# Altium project Soccer A.PrjPCB
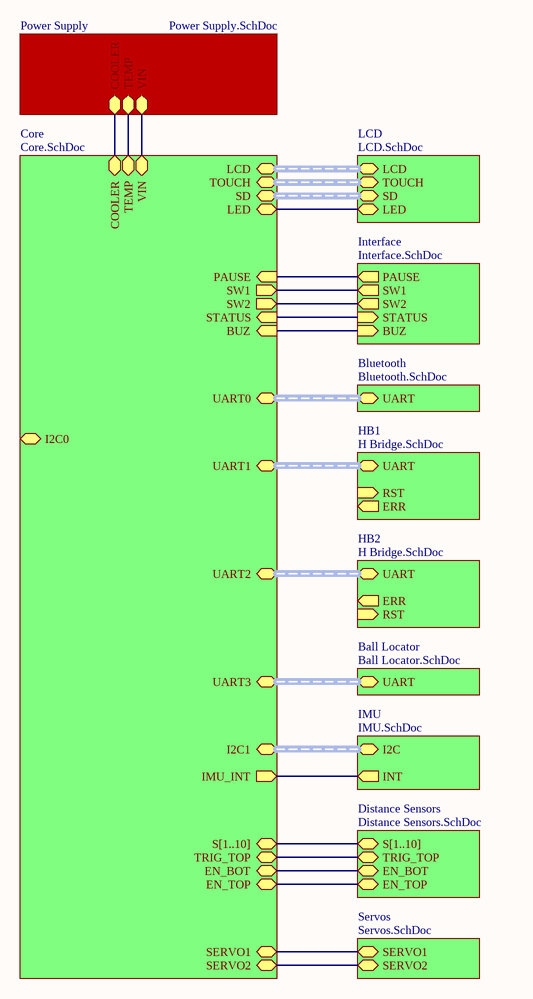
[diagram p0: General.SchDoc]
13 sheets, 238 parts. Net scope: hierarchical (ports join the sheet entries above them; power ports are global).
Board file: Main.PcbDoc
Sheets:
  General.SchDoc
    Core = Core.SchDoc
    IMU = IMU.SchDoc
    Bluetooth = Bluetooth.SchDoc
    HB1 = H Bridge.SchDoc
    HB2 = H Bridge.SchDoc
    LCD = LCD.SchDoc
    Interface = Interface.SchDoc
    Ball Locator = Ball Locator.SchDoc
      DBS1 = Digital Ball Sensor.SchDoc
      DBS2 = Digital Ball Sensor.SchDoc
      DBS3 = Digital Ball Sensor.SchDoc
      DBS4 = Digital Ball Sensor.SchDoc
      DBS5 = Digital Ball Sensor.SchDoc
      DBS6 = Digital Ball Sensor.SchDoc
      DBS7 = Digital Ball Sensor.SchDoc
      DBS8 = Digital Ball Sensor.SchDoc
      DBS9 = Digital Ball Sensor.SchDoc
      DBS10 = Digital Ball Sensor.SchDoc
      DBS11 = Digital Ball Sensor.SchDoc
      DBS12 = Digital Ball Sensor.SchDoc
      DBS13 = Digital Ball Sensor.SchDoc
      DBS14 = Digital Ball Sensor.SchDoc
      DBS15 = Digital Ball Sensor.SchDoc
      DBS16 = Digital Ball Sensor.SchDoc
      1 = Analog Ball Sensor.SchDoc
      2 = Analog Ball Sensor.SchDoc
    Power Supply = Power Supply.SchDoc
    Distance Sensors = Distance Sensors.SchDoc
    Servos = Servos.SchDoc

## Sheet General.SchDoc
size A4; SheetNumber: 1; SheetTotal: 3

### Sub-sheets
Ball Locator = Ball Locator.SchDoc: UART (harness UART)
Bluetooth = Bluetooth.SchDoc: UART (harness UART)
Core = Core.SchDoc: VIN, LCD (harness LCD_BUS), TOUCH (harness TOUCH_BUS), PAUSE (in), UART3 (harness UART), UART1 (harness UART), UART2 (harness UART), I2C0 (harness I2C), I2C1 (harness I2C), UART0 (harness UART), STATUS (in), SW1 (out), SW2 (out), LED, SD (harness SD), IMU_INT (out), S[1..10], EN_BOT, EN_TOP, SERVO1, SERVO2, TEMP, COOLER, TRIG_TOP, BUZ (in)
Distance Sensors = Distance Sensors.SchDoc: S[1..10], EN_BOT, EN_TOP, TRIG_TOP
HB1 = H Bridge.SchDoc: RST (in), ERR (out), UART (harness UART)
HB2 = H Bridge.SchDoc: RST (in), ERR (out), UART (harness UART)
IMU = IMU.SchDoc: INT (out), I2C (harness I2C)
Interface = Interface.SchDoc: PAUSE (out), SW1 (out), SW2 (out), STATUS (in), BUZ (in)
LCD = LCD.SchDoc: LCD (harness LCD_BUS), TOUCH (harness TOUCH_BUS), LED, SD (harness SD)
Power Supply = Power Supply.SchDoc: VIN, TEMP, COOLER
Servos = Servos.SchDoc: SERVO1, SERVO2

### Nets
Net*_3: sheet Core/PAUSE, sheet Interface/PAUSE
Net*_4: sheet Core/EN_TOP, sheet Distance Sensors/EN_TOP
Net*_5: sheet Core/EN_BOT, sheet Distance Sensors/EN_BOT
Net*_6: sheet Core/SW1, sheet Interface/SW1
Net*_7: sheet Core/SW2, sheet Interface/SW2
Net*_8: sheet Core/STATUS, sheet Interface/STATUS
Net*_9: sheet Core/LED, sheet LCD/LED
Net*_10: sheet Core/TRIG_TOP, sheet Distance Sensors/TRIG_TOP
Net*_11: sheet Core/COOLER, sheet Power Supply/COOLER
Net*_12: sheet Core/SERVO1, sheet Servos/SERVO1
Net*_13: sheet Core/SERVO2, sheet Servos/SERVO2
Net*_22: sheet Core/BUZ, sheet Interface/BUZ
Net*_32: sheet Core/IMU_INT, sheet IMU/INT
Net*_A10: sheet Core/TEMP, sheet Power Supply/TEMP
Net*_A11: sheet Core/VIN, sheet Power Supply/VIN

### Buses and harness runs
bus sheet Core/S[1..10] = sheet Distance Sensors/S[1..10]
harness sheet Ball Locator/UART = sheet Core/UART3
harness sheet Bluetooth/UART = sheet Core/UART0
harness sheet Core/I2C1 = sheet IMU/I2C
harness sheet Core/LCD = sheet LCD/LCD
harness sheet Core/SD = sheet LCD/SD
harness sheet Core/TOUCH = sheet LCD/TOUCH
harness sheet Core/UART1 = sheet HB1/UART
harness sheet Core/UART2 = sheet HB2/UART

## Sheet Core.SchDoc
size A4
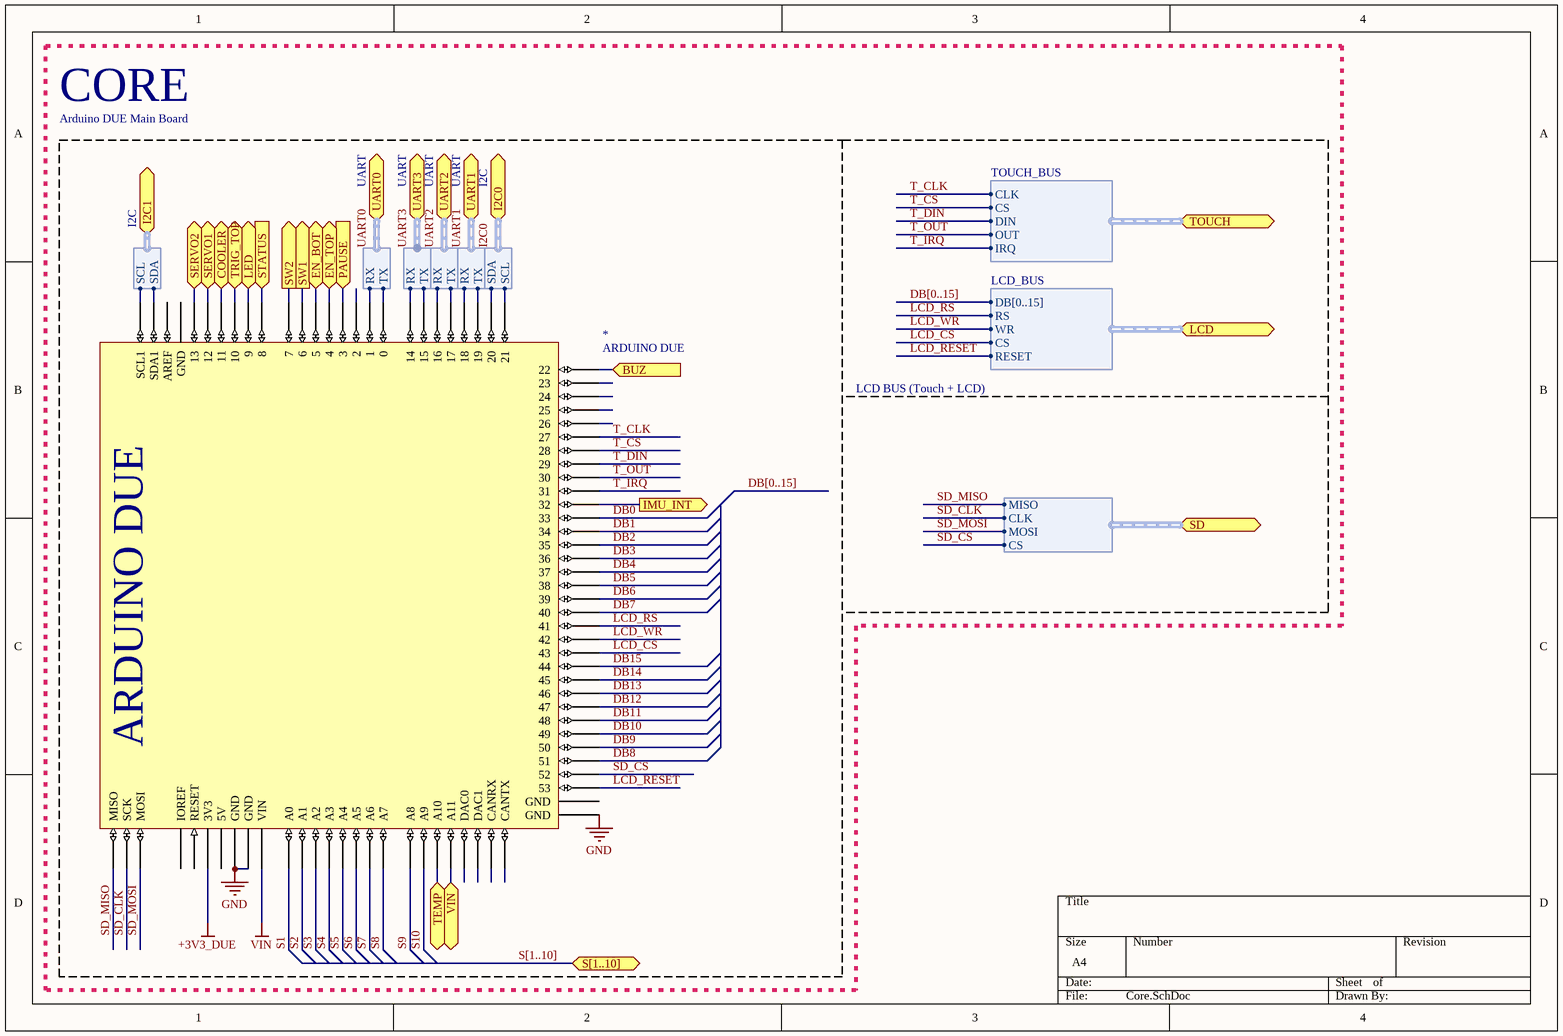
[diagram p1: Core.SchDoc]

### Parts
*  ARDUINO DUE  [ARDUINO-DUE]

### Blocks framed on the sheet
Arduino DUE Main Board: *

### Ports
BUZ (in), COOLER, EN_BOT, EN_TOP, I2C0 (harness I2C), I2C1 (harness I2C), IMU_INT (out), LCD (harness LCD_BUS), LED, PAUSE (in), S[1..10], SD (harness SD), SERVO1, SERVO2, STATUS (in), SW1 (out), SW2 (out), TEMP, TOUCH (harness TOUCH_BUS), TRIG_TOP, UART0 (harness UART), UART1 (harness UART), UART2 (harness UART), UART3 (harness UART), VIN

### Harnesses
LCD_BUS: CS, DB[0..15], RESET, RS, WR
TOUCH_BUS: CLK, CS, DIN, OUT, IRQ
UART: RX, TX
I2C: SDA, SCL
SD: MISO, MOSI, CLK, CS

### Nets
+3V3_DUE: *.3V3
GND: *.GND2(GND) *.GND3(GND) *.GND5(GND)
VIN: *.VIN
BL.RX: *.14 ; port UART3.RX
BL.TX: *.15 ; port UART3.TX
DB0: *.33
DB1: *.34
DB2: *.35
DB3: *.36
DB4: *.37
DB5: *.38
DB6: *.39
DB7: *.40
DB8: *.51
DB9: *.50
DB10: *.49
DB11: *.48
DB12: *.47
DB13: *.46
DB14: *.45
DB15: *.44
LCD_CS: *.43 ; port LCD.CS
LCD_RESET: *.53 ; port LCD.RESET
LCD_RS: *.41 ; port LCD.RS
LCD_WR: *.42 ; port LCD.WR
RX: *.16 ; port UART2.RX
RX: *.18 ; port UART1.RX  [a separate net that carries the same name]
S1: *.A0
S2: *.A1
S3: *.A2
S4: *.A3
S5: *.A4
S6: *.A5
S7: *.A6
S8: *.A7
S9: *.A8
S10: *.A9
SD_CLK: *.SCK ; port SD.CLK
SD_CS: *.52 ; port SD.CS
SD_MISO: *.MISO ; port SD.MISO
SD_MOSI: *.MOSI ; port SD.MOSI
T_CLK: *.27 ; port TOUCH.CLK
T_CS: *.28 ; port TOUCH.CS
T_DIN: *.29 ; port TOUCH.DIN
T_IRQ: *.31 ; port TOUCH.IRQ
T_OUT: *.30 ; port TOUCH.OUT
UART.RX: *.1 ; port UART0.RX
UART.TX: *.0 ; port UART0.TX
Net*_3: *.3 ; port PAUSE
Net*_4: *.4 ; port EN_TOP
Net*_5: *.5 ; port EN_BOT
Net*_6: *.6 ; port SW1
Net*_7: *.7 ; port SW2
Net*_8: *.8 ; port STATUS
Net*_9: *.9 ; port LED
Net*_10: *.10 ; port TRIG_TOP
Net*_11: *.11 ; port COOLER
Net*_12: *.12 ; port SERVO1
Net*_13: *.13 ; port SERVO2
Net*_17: *.17 ; port UART2.TX
Net*_19: *.19 ; port UART1.TX
Net*_20: *.20 ; port I2C0.SDA
Net*_21: *.21 ; port I2C0.SCL
Net*_22: *.22 ; port BUZ
Net*_32: *.32 ; port IMU_INT
Net*_A10: *.A10 ; port TEMP
Net*_A11: *.A11 ; port VIN
Net*_SCL1: *.SCL1 ; port I2C1.SCL
Net*_SDA1: *.SDA1 ; port I2C1.SDA

Not connected (* = marked no-connect by the designer): * 2 5V 23 24 25 26 AREF CANRX CANTX DAC0 DAC1 GND1(GND) GND4(GND) IOREF RESET

### Buses and harness runs
bus DB[0..15]
bus S[1..10] = port S[1..10]

### Notes on the sheet
- CORE
- LCD BUS (Touch + LCD)
- Labels drawn without touching a wire or pin: I2C0, UART0, UART1, UART2, UART3

## Sheet IMU.SchDoc: IMU Sensor
size A4; DrawnBy: Ivan Seidel; ProjectName: Soccer B Robot
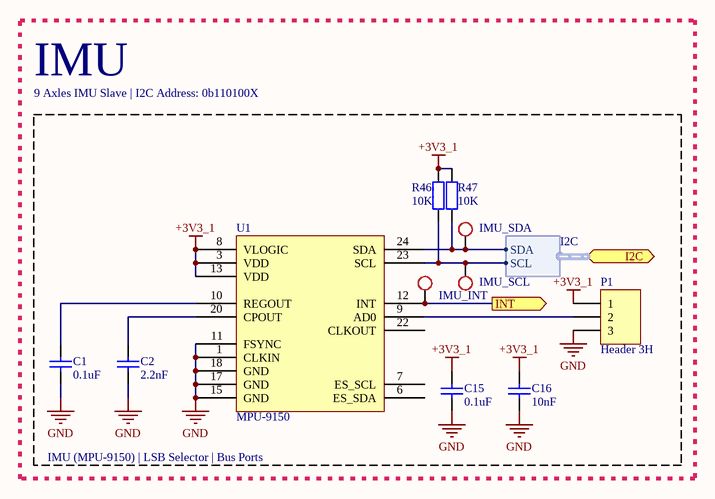
[diagram p2: IMU.SchDoc]

### Parts
C1  0.1uF  [C0805]
C2  2.2nF  [C0805]
C15  0.1uF  [C0805]
C16  10nF  [C0805]
IMU_INT  Test Point  [TP1]  (value not drawn)  (no BOM)
IMU_SCL  Test Point  [TP1]  (value not drawn)  (no BOM)
IMU_SDA  Test Point  [TP1]  (value not drawn)  (no BOM)
P1  Header 3H  [HDR1X3H]
R46  10K  [RES1206]
R47  10K  [RES1206]
U1  MPU-9150  [QFN50P400X400X100-24N]

### Ports
I2C (harness I2C), INT (out)

### Harnesses
I2C: SCL, SDA

### Nets
+3V3_1: C15.2 C16.2 P1.1 R46.1 R47.1 U1.3(VDD) U1.8(VLOGIC) U1.13(VDD)
GND: C1.1 C2.1 C15.1 C16.1 P1.3 U1.1(CLKIN) U1.11(FSYNC) U1.15(GND) U1.17(GND) U1.18(GND)
Net*_32: IMU_INT.1 U1.12(INT) ; port INT
Net*_SCL1: IMU_SCL.1 R46.2 U1.23(SCL) ; port I2C.SCL
Net*_SDA1: IMU_SDA.1 R47.2 U1.24(SDA) ; port I2C.SDA
NetC1_2: C1.2 U1.10(REGOUT)
NetC2_2: C2.2 U1.20(CPOUT)
NetP1_2: P1.2 U1.9(AD0)

Not connected (* = marked no-connect by the designer): U1 6(ES_SDA) 7(ES_SCL) 22(CLKOUT)

### Notes on the sheet
- IMU
- 9 Axles IMU Slave | I2C Address: 0b110100X
- IMU (MPU-9150) | LSB Selector | Bus Ports

### Library data of the parts
C1 C2 C15 C16 = Cap Semi: Capacitor (Semiconductor SIM Model); Published: 8-Jun-2000; LatestRevisionDate: 29-May-2009; LatestRevisionNote: IPC-7351 Footprint Added.; PackageReference: C1206; Publisher: Altium Limited; PackageDescription: Chip Capacitor
  C1 C15: Value: 0.1uF
  C2: Value: 2.2nF
  C16: Value: 10nF
IMU_INT IMU_SCL IMU_SDA = Test Point: Test Point for Osciloscope measurements
P1 = Header 3H: Header, 3-Pin, Right Angle; LatestRevisionDate: 17-Jul-2002; LatestRevisionNote: Re-released for DXP Platform.; Publisher: Altium Limited
R46 R47 = RES
U1 = MPU-9150: InveSense MPU-9150 IMU 9 axles

## Sheet Bluetooth.SchDoc
size A4
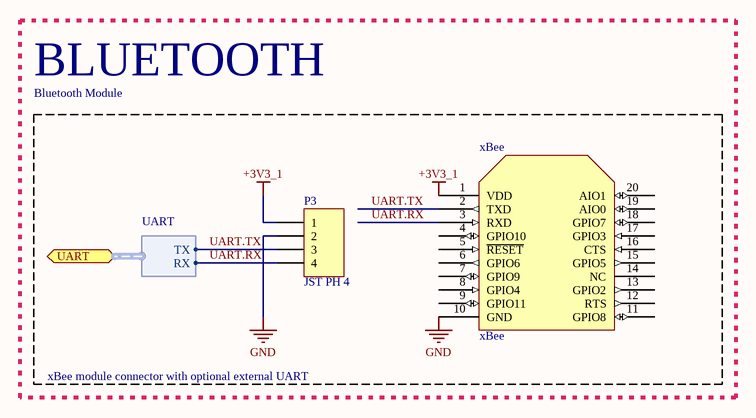
[diagram p3: Bluetooth.SchDoc]

### Parts
P3  JST PH 4  [B4B-PH-K]
xBee  xBee  [xBee]

### Blocks framed on the sheet
BLUETOOTH: P3 xBee

### Ports
UART (harness UART)

### Harnesses
UART: RX, TX

### Nets
+3V3_1: P3.1 xBee.1(VDD)
GND: P3.2 xBee.10(GND)
UART.RX: P3.4 xBee.3(RXD) ; port UART.RX
UART.TX: P3.3 xBee.2(TXD) ; port UART.TX

Not connected (* = marked no-connect by the designer): xBee 4(GPIO10) 5(~{RESET}) 6(GPIO6) 7(GPIO9) 8(GPIO4) 9(GPIO11) 11(GPIO8) 12(RTS) 13(GPIO2) 14(NC) 15(GPIO5) 16(CTS) 17(GPIO3) 18(GPIO7) 19(AIO0) 20(AIO1)

### Notes on the sheet
- Bluetooth Module
- xBee module connector with optional external UART

## Sheet H Bridge.SchDoc
size A4
Used 2 times, as channels HB1, HB2. Parts and nets are listed once, with the designators drawn on the sheet.
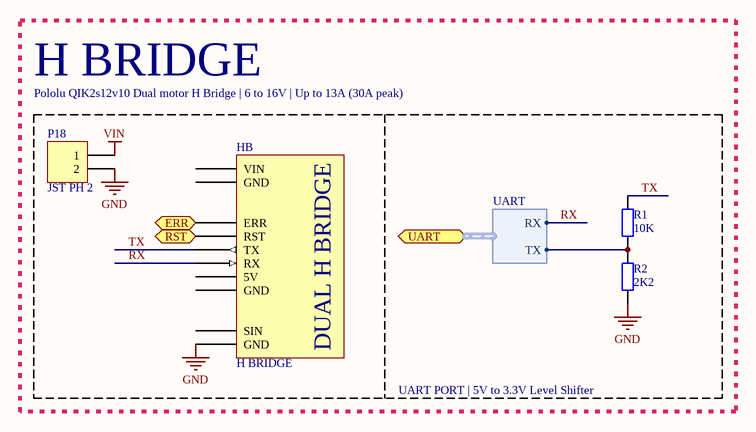
[diagram p4: H Bridge.SchDoc]

### Parts
HB  H BRIDGE  [POLOLU-QIK-2S12V10-BOTTOM]
P18  JST PH 2  [B2B-PH-K]
R1  10K  [RES1206]
R2  2K2  [RES1206]

### Blocks framed on the sheet
UART PORT | 5V to 3.3V Level Shifter: HB P18 R1 R2

### Ports
ERR (out), RST (in), UART (harness UART)

### Harnesses
UART: RX, TX

### Nets
GND: HB.GND3(GND) P18.2 R2.1
VIN: P18.1
ERR: HB.ERR ; port ERR
RST: HB.RST ; port RST
RX: HB.RX ; port UART.RX
TX: HB.TX R1.2
NetR1_1: R1.1 R2.2 ; port UART.TX

Not connected (* = marked no-connect by the designer): HB 5V GND1(GND) GND2(GND) SIN VIN

### Channels
HB1: designators end in _HB1; ports ERR=NetHB_HB1_ERR RST=NetHB_HB1_RST
HB2: designators end in _HB2; ports ERR=NetHB_HB2_ERR RST=NetHB_HB2_RST

### Notes on the sheet
- H BRIDGE
- Pololu QIK2s12v10 Dual motor H Bridge | 6 to 16V | Up to 13A (30A peak)
- (in symbol POLOLU-QIK-2S12V10) DUAL H BRIDGE

### Library data of the parts
HB = POLOLU-QIK-2S12V10: POLOLU QIK 2S12V10 DUAL H BRIDGE
R1 R2 = RES

## Sheet LCD.SchDoc
size A4
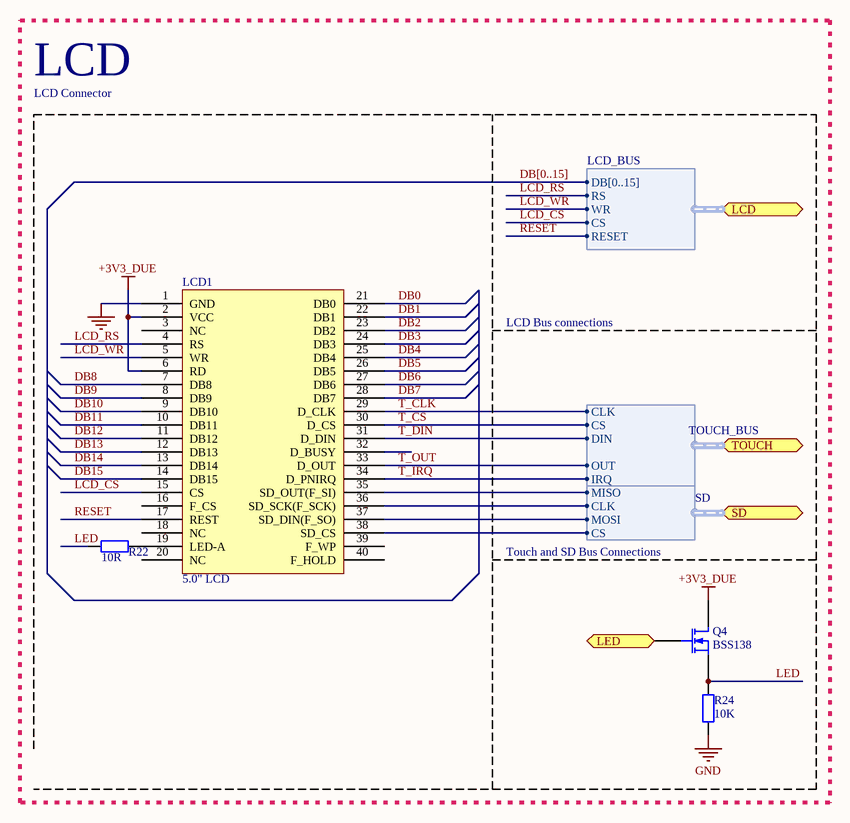
[diagram p5: LCD.SchDoc]

### Parts
LCD1  5.0" LCD  [TFT LCD 5.0 INCHES]
Q4  BSS138  [SOT23]
R22  10R  [RES1206]
R24  10K  [RES1206]

### Ports
LCD (harness LCD_BUS), LED, SD (harness SD), TOUCH (harness TOUCH_BUS)

### Harnesses
LCD_BUS: DB[0..15], RS, WR, CS, RESET
TOUCH_BUS: CLK, CS, DIN, OUT, IRQ
SD: MISO, MOSI, CLK, CS

### Nets
+3V3_DUE: LCD1.2(VCC) LCD1.6(RD) Q4.1(D)
GND: LCD1.1(GND) R24.2
DB0: LCD1.21(DB0)
DB1: LCD1.22(DB1)
DB2: LCD1.23(DB2)
DB3: LCD1.24(DB3)
DB4: LCD1.25(DB4)
DB5: LCD1.26(DB5)
DB6: LCD1.27(DB6)
DB7: LCD1.28(DB7)
DB8: LCD1.7(DB8)
DB9: LCD1.8(DB9)
DB10: LCD1.9(DB10)
DB11: LCD1.10(DB11)
DB12: LCD1.11(DB12)
DB13: LCD1.12(DB13)
DB14: LCD1.13(DB14)
DB15: LCD1.14(DB15)
LCD_CS: LCD1.15(CS) ; port LCD.CS
LCD_RS: LCD1.4(RS) ; port LCD.RS
LCD_WR: LCD1.5(WR) ; port LCD.WR
LED: Q4.2(S) R22.2 R24.1
RESET: LCD1.17(REST) ; port LCD.RESET  [project net LCD_RESET]
SD_CLK: LCD1.36(SD_SCK(F_SCK)) ; port SD.CLK
SD_CS: LCD1.38(SD_CS) ; port SD.CS
SD_MISO: LCD1.35(SD_OUT(F_SI)) ; port SD.MISO
SD_MOSI: LCD1.37(SD_DIN(F_SO)) ; port SD.MOSI
T_CLK: LCD1.29(D_CLK) ; port TOUCH.CLK
T_CS: LCD1.30(D_CS) ; port TOUCH.CS
T_DIN: LCD1.31(D_DIN) ; port TOUCH.DIN
T_IRQ: LCD1.34(D_PNIRQ) ; port TOUCH.IRQ
T_OUT: LCD1.33(D_OUT) ; port TOUCH.OUT
Net*_9: Q4.3(G) ; port LED
NetLCD1_19: LCD1.19(LED-A) R22.1

Not connected (* = marked no-connect by the designer): LCD1 3(NC) 16(F_CS) 18(NC) 20(NC) 32(D_BUSY) 39(F_WP) 40(F_HOLD)

### Buses and harness runs
bus DB[0..15]

### Notes on the sheet
- LCD
- LCD Connector
- LCD Bus connections
- Touch and SD Bus Connections

### Library data of the parts
LCD1 = TFT LCD 5.0 INCHES
Q4 = BSS138: N-Channel Enhancement Mode Vertical DMOS FET; Published: 17-Dec-2003; DatasheetVersion: Mar-96; PackageVersion: 1996; PackageReference: SOT23; Publisher: Altium Limited; PackageDescription: SOT-23; 3 Leads; Body 3.1 x 2.5 mm, inc. leads (LxW max), Alternate Lead Configuration; ComponentLink1Description: Manufacturer Link; ComponentLink1URL: http://www.zetex.com/; ComponentLink2Description: Datasheet; ComponentLink2URL: www.zetex.com/3.0/pdf/BSS138.pdf
R22 R24 = RES

## Sheet Interface.SchDoc
size A4
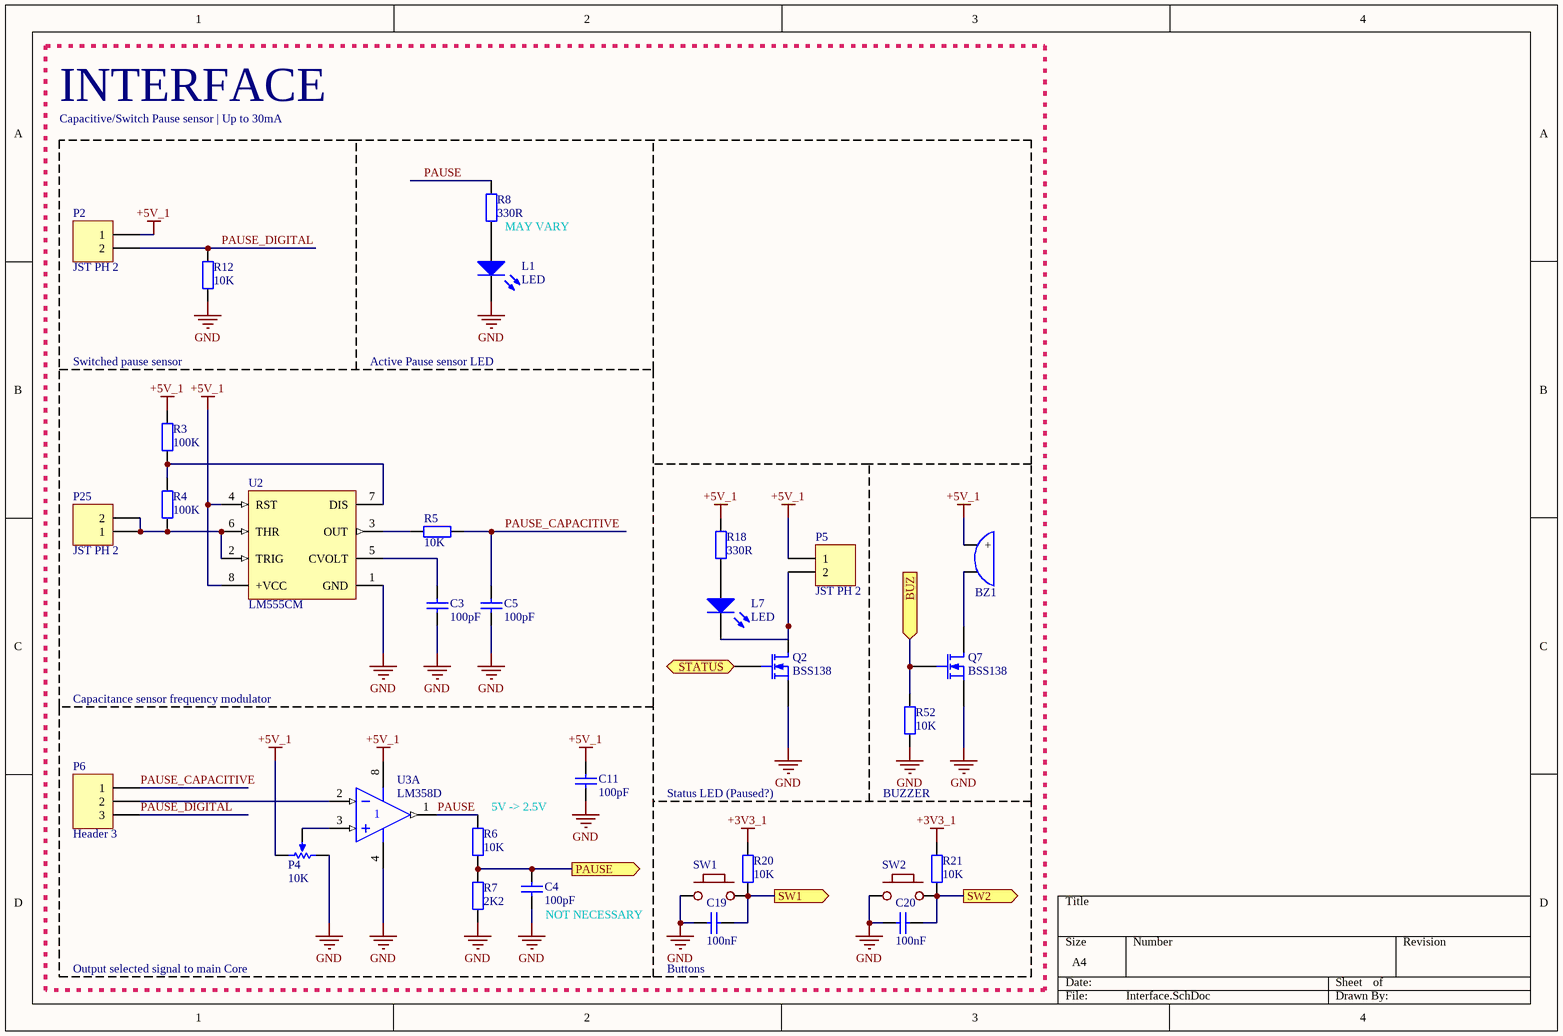
[diagram p6: Interface.SchDoc]

### Parts
BZ1  Buzzer  [BUZZER]  (value not drawn)
C3  100pF  [C0805]
C4  100pF  [C0805]
C5  100pF  [C0805]
C11  100pF  [C0805]
C19  100nF  [6-0805_N]
C20  100nF  [6-0805_N]
L1  LED  [LED0805]
L7  LED  [LED0805]
P2  JST PH 2  [B2B-PH-K]
P4  10K  [TRIMPOT-3296W]
P5  JST PH 2  [B2B-PH-K]
P6  Header 3  [HDR1X3]
P25  JST PH 2  [B2B-PH-K]
Q2  BSS138  [SOT23]
Q7  BSS138  [SOT23]
R3  100K  [RES1206]
R4  100K  [RES1206]
R5  10K  [RES1206]
R6  10K  [RES1206]
R7  2K2  [RES1206]
R8  330R  [RES1206]
R12  10K  [RES1206]
R18  330R  [RES1206]
R20  10K  [RES1206]
R21  10K  [RES1206]
R52  10K  [RES1206]
SW1  PUSH BUTTON  [PUSH-BUTTON 5,2X1,6MM]  (value not drawn)
SW2  PUSH BUTTON  [PUSH-BUTTON 5,2X1,6MM]  (value not drawn)
U2  LM555CM  [M08A_N]
U3  LM358D  [751-02_N]  (part A of 2)

### Ports
BUZ (in), PAUSE (out), STATUS (in), SW1 (out), SW2 (out)

### Nets
+3V3_1: R20.1 R21.1
+5V_1: BZ1.1(+) C11.2 P2.1 P4.3(BOT) P5.1 R3.2 R18.1 U2.4(RST) U2.8(+VCC) U3.8(V+)
GND: C3.1 C4.1 C5.1 C11.1 C19.2 C20.2 L1.2(K) P4.1(TOP) Q2.2(S) Q7.2(S) R7.1 R12.1 R52.2 SW1.1 SW2.1 U2.1(GND) U3.4(V-)
PAUSE: R6.2 R8.1 U3.1(OUT)
PAUSE_CAPACITIVE: C5.2 P6.1 R5.1
PAUSE_DIGITAL: P2.2 P6.3 R12.2
Net*_3: C4.2 R6.1 R7.2 ; port PAUSE
Net*_6: C19.1 R20.2 SW1.2 ; port SW1
Net*_7: C20.1 R21.2 SW2.2 ; port SW2
Net*_8: Q2.3(G) ; port STATUS
Net*_22: Q7.3(G) R52.1 ; port BUZ
NetBZ1_2: BZ1.2 Q7.1(D)
NetC3_2: C3.2 U2.5(CVOLT)
NetL1_1: L1.1(A) R8.2
NetL7_1: L7.1(A) R18.2
NetL7_2: L7.2(K) P5.2 Q2.1(D)
NetP4_2: P4.2(TAP) U3.3(IN+)
NetP6_2: P6.2 U3.2(IN-)
NetP25_1: P25.1 P25.2 R4.1 U2.2(TRIG) U2.6(THR)
NetR3_1: R3.1 R4.2 U2.7(DIS)
NetR5_2: R5.2 U2.3(OUT)

### Notes on the sheet
- INTERFACE
- Capacitive/Switch Pause sensor | Up to 30mA
- (near R8) MAY VARY
- Switched pause sensor
- Active Pause sensor LED
- Capacitance sensor frequency modulator
- (near R6) 5V -> 2.5V
- Status LED (Paused?)
- BUZZER
- (near C4) NOT NECESSARY
- Output selected signal to main Core
- (near C19) Buttons

### Library data of the parts
C3-C5 C11 C19 C20 = Cap Semi: Capacitor (Semiconductor SIM Model); Published: 8-Jun-2000; LatestRevisionDate: 29-May-2009; LatestRevisionNote: IPC-7351 Footprint Added.; PackageReference: C1206; Publisher: Altium Limited; PackageDescription: Chip Capacitor
  C19 C20: Value: 100nF
P4 = TRIMPOT
P6 = Header 3: Header, 3-Pin; LatestRevisionDate: 17-Jul-2002; LatestRevisionNote: Re-released for DXP Platform.; Publisher: Altium Limited
Q2 Q7 = BSS138: as Q4 on sheet LCD; Published: 17-Dec-2003; DatasheetVersion: Mar-96; PackageVersion: 1996; PackageReference: SOT23; Publisher: Altium Limited; PackageDescription: SOT-23; 3 Leads; Body 3.1 x 2.5 mm, inc. leads (LxW max), Alternate Lead Configuration; ComponentLink1Description: Manufacturer Link; ComponentLink1URL: http://www.zetex.com/; ComponentLink2Description: Datasheet; ComponentLink2URL: www.zetex.com/3.0/pdf/BSS138.pdf
R3-R8 R12 R18 R20 R21 R52 = RES
U2 = LM555CM: Timer, 8-pin Narrow SOIC; Manufacturer: National Semiconductor; PackageTopMarking: NSZXTT*LM*555CM; PowerWise: N; CompType: Analog IC; Published: 4-Dec-2008; DatasheetVersion: Jul-2006; PackageVersion: revM, May-2009; PackageReference: M08A; Publisher: Altium Limited; PackageDescription: SOIC Narrow, 4.9 x 3.9 x 1.45mm, 8 Lead, 1.27mm Pitch; Supplier 1: Farnell; Supplier Part Number 1: 9488227; PartNumber: LM555CM; RoHS: N; PinCount: 8; Code_JEDEC: MS-012-AA; Code_IPC: SOIC127P600-8; ComponentLink1Description: LM555 Datasheet; ComponentLink1URL: http://www.national.com/ds/LM/LM555.pdf; ComponentLink2Description: LM555 Web Page; ComponentLink2URL: http://www.national.com/pf/LM/LM555.html; ComponentLink3Description: M08A Package Page; ComponentLink3URL: http://www.national.com/packaging/folders/m08a.html
U3 = LM358D: Dual Low-Power Operational Amplifier; Published: 17-Jul-2002; LatestRevisionDate: 13-Apr-2006; LatestRevisionNote: IPC-7351 Footprint Added.; DatasheetVersion: 1988; PackageReference: 751-02; Publisher: Altium Limited; PackageDescription: 8-Pin Small Outline Integrated Circuit 1.27 mm Pitch; Code_JEDEC: MS-012-AA; Code_IPC: SOIC127P600-8; ComponentLink1Description: Manufacturer Link; ComponentLink1URL: http://www.onsemi.com/site/products/parametrics/0,4446,251,00.html; ComponentLink2Description: Datasheet; ComponentLink2URL: http://www.onsemi.com/pub/Collateral/LM358-D.PDF

## Sheet Ball Locator.SchDoc
size A4
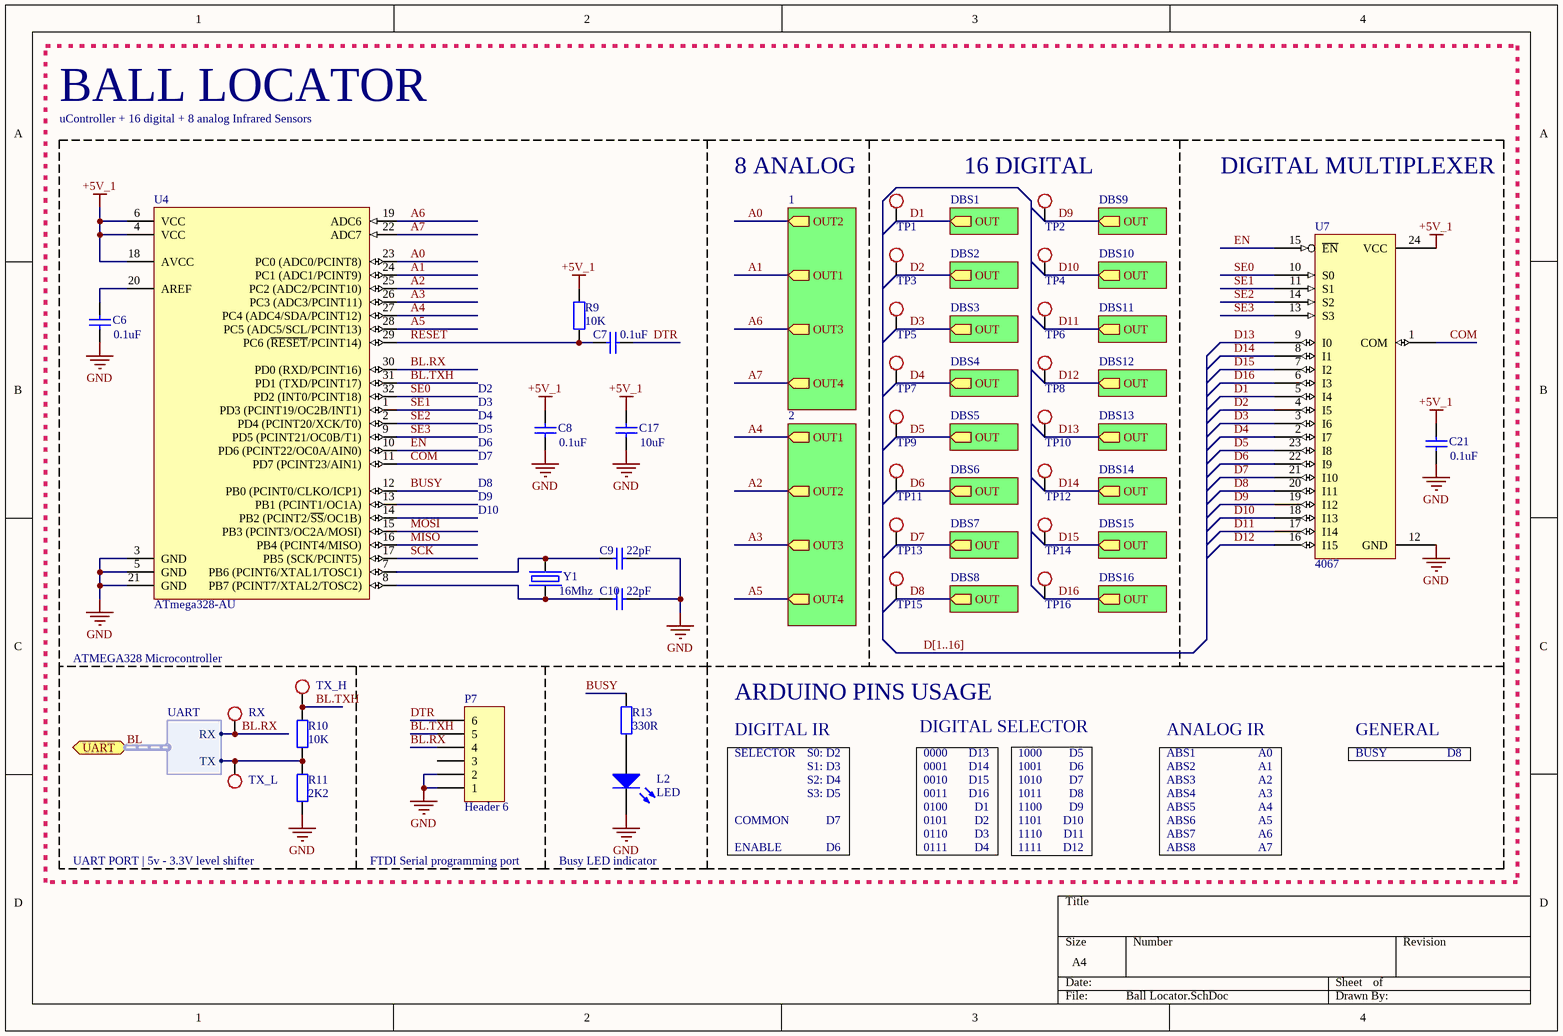
[diagram p7: Ball Locator.SchDoc]

### Parts
C6  0.1uF  [C0805]
C7  0.1uF  [C0805]
C8  0.1uF  [C0805]
C9  22pF  [C0805]
C10  22pF  [C0805]
C17  10uF  [C1206]
C21  0.1uF  [C0805]
L2  LED  [LED0805]
P7  Header 6  [HDR1X6]
R9  10K  [RES1206]
R10  10K  [RES1206]
R11  2K2  [RES1206]
R13  330R  [RES1206]
RX  Test Point  [TP1]  (value not drawn)  (no BOM)
TP1  Test Point  [TP1]  (value not drawn)
TP2  Test Point  [TP1]  (value not drawn)
TP3  Test Point  [TP1]  (value not drawn)
TP4  Test Point  [TP1]  (value not drawn)
TP5  Test Point  [TP1]  (value not drawn)
TP6  Test Point  [TP1]  (value not drawn)
TP7  Test Point  [TP1]  (value not drawn)
TP8  Test Point  [TP1]  (value not drawn)
TP9  Test Point  [TP1]  (value not drawn)
TP10  Test Point  [TP1]  (value not drawn)
TP11  Test Point  [TP1]  (value not drawn)
TP12  Test Point  [TP1]  (value not drawn)
TP13  Test Point  [TP1]  (value not drawn)
TP14  Test Point  [TP1]  (value not drawn)
TP15  Test Point  [TP1]  (value not drawn)
TP16  Test Point  [TP1]  (value not drawn)
TX_H  Test Point  [TP1]  (value not drawn)  (no BOM)
TX_L  Test Point  [TP1]  (value not drawn)  (no BOM)
U4  ATmega328-AU  [32A_N]
U7  4067  [SSOP-24]
Y1  16Mhz  [OSC-2-PIN-TH]

### Sub-sheets
1 = Analog Ball Sensor.SchDoc: OUT1 (out), OUT2 (out), OUT3 (out), OUT4 (out)
2 = Analog Ball Sensor.SchDoc: OUT1 (out), OUT2 (out), OUT3 (out), OUT4 (out)
DBS1 = Digital Ball Sensor.SchDoc: OUT (out)
DBS2 = Digital Ball Sensor.SchDoc: OUT (out)
DBS3 = Digital Ball Sensor.SchDoc: OUT (out)
DBS4 = Digital Ball Sensor.SchDoc: OUT (out)
DBS5 = Digital Ball Sensor.SchDoc: OUT (out)
DBS6 = Digital Ball Sensor.SchDoc: OUT (out)
DBS7 = Digital Ball Sensor.SchDoc: OUT (out)
DBS8 = Digital Ball Sensor.SchDoc: OUT (out)
DBS9 = Digital Ball Sensor.SchDoc: OUT (out)
DBS10 = Digital Ball Sensor.SchDoc: OUT (out)
DBS11 = Digital Ball Sensor.SchDoc: OUT (out)
DBS12 = Digital Ball Sensor.SchDoc: OUT (out)
DBS13 = Digital Ball Sensor.SchDoc: OUT (out)
DBS14 = Digital Ball Sensor.SchDoc: OUT (out)
DBS15 = Digital Ball Sensor.SchDoc: OUT (out)
DBS16 = Digital Ball Sensor.SchDoc: OUT (out)

### Ports
UART (harness UART)

### Harnesses
UART: RX, TX

### Nets
+5V_1: C8.2 C17.2 C21.2 R9.1 U4.4(VCC) U4.6(VCC) U4.18(AVCC) U7.24(VCC)
GND: C6.1 C8.1 C9.2 C10.2 C17.1 C21.1 L2.2(K) P7.1 P7.2 R11.1 U4.3(GND) U4.5(GND) U4.21(GND) U7.12(GND)
A0: U4.23(PC0_(ADC0/PCINT8)) ; sheet 1/OUT2
A1: U4.24(PC1_(ADC1/PCINT9)) ; sheet 1/OUT1
A2: U4.25(PC2_(ADC2/PCINT10)) ; sheet 2/OUT2
A3: U4.26(PC3_(ADC3/PCINT11)) ; sheet 2/OUT3
A4: U4.27(PC4_(ADC4/SDA/PCINT12)) ; sheet 2/OUT1
A5: U4.28(PC5_(ADC5/SCL/PCINT13)) ; sheet 2/OUT4
A6: U4.19(ADC6) ; sheet 1/OUT3
A7: U4.22(ADC7) ; sheet 1/OUT4
BL.RX: P7.4 RX.1 U4.30(PD0_(RXD/PCINT16)) ; port UART.RX
BL.TX: R10.1 R11.2 TX_L.1 ; port UART.TX
BL.TXH: P7.5 R10.2 TX_H.1 U4.31(PD1_(TXD/PCINT17))
BUSY: R13.2 U4.12(PB0_(PCINT0/CLKO/ICP1))
COM: U4.11(PD7_(PCINT23/AIN1)) U7.1(COM)
D1: TP1.1 U7.5(I4) ; sheet DBS1/OUT
D2: TP3.1 U7.4(I5) ; sheet DBS2/OUT
D3: TP5.1 U7.3(I6) ; sheet DBS3/OUT
D4: TP7.1 U7.2(I7) ; sheet DBS4/OUT
D5: TP9.1 U7.23(I8) ; sheet DBS5/OUT
D6: TP11.1 U7.22(I9) ; sheet DBS6/OUT
D7: TP13.1 U7.21(I10) ; sheet DBS7/OUT
D8: TP15.1 U7.20(I11) ; sheet DBS8/OUT
D9: TP2.1 U7.19(I12) ; sheet DBS9/OUT
D10: TP4.1 U7.18(I13) ; sheet DBS10/OUT
D11: TP6.1 U7.17(I14) ; sheet DBS11/OUT
D12: TP8.1 U7.16(I15) ; sheet DBS12/OUT
D13: TP10.1 U7.9(I0) ; sheet DBS13/OUT
D14: TP12.1 U7.8(I1) ; sheet DBS14/OUT
D15: TP14.1 U7.7(I2) ; sheet DBS15/OUT
D16: TP16.1 U7.6(I3) ; sheet DBS16/OUT
DTR: C7.2 P7.6
EN: U4.10(PD6_(PCINT22/OC0A/AIN0)) U7.15(~{EN})
MISO: U4.16(PB4_(PCINT4/MISO))
MOSI: U4.15(PB3_(PCINT3/OC2A/MOSI))
RESET: C7.1 R9.2 U4.29(PC6_(~{RESET}/PCINT14))
SCK: U4.17(PB5_(SCK/PCINT5))
SE0: U4.32(PD2_(INT0/PCINT18)) U7.10(S0)
SE1: U4.1(PD3_(PCINT19/OC2B/INT1)) U7.11(S1)
SE2: U4.2(PD4_(PCINT20/XCK/T0)) U7.14(S2)
SE3: U4.9(PD5_(PCINT21/OC0B/T1)) U7.13(S3)
NetC6_2: C6.2 U4.20(AREF)
NetC9_1: C9.1 U4.7(PB6_(PCINT6/XTAL1/TOSC1)) Y1.1
NetC10_1: C10.1 U4.8(PB7_(PCINT7/XTAL2/TOSC2)) Y1.2
NetL2_1: L2.1(A) R13.1

Not connected (* = marked no-connect by the designer): P7 3; U4 13(PB1_(PCINT1/OC1A)) 14(PB2_(PCINT2/~{SS}/OC1B))

### Buses and harness runs
bus D[1..16]
harness BL = port UART

### Notes on the sheet
- BALL LOCATOR
- uController + 16 digital + 8 analog Infrared Sensors
- 8 ANALOG
- (near TP2) 16 DIGITAL
- DIGITAL MULTIPLEXER
- D2
- D3
- D4
- D5
- D6
- D7
- D8
- D9
- D10
- ATMEGA328 Microcontroller
- ARDUINO PINS USAGE
- SELECTOR
- DIGITAL IR
- S0: D2
- S1: D3
- S2: D4
- DIGITAL SELECTOR
- 0000
- 0001
- 0010
- D13
- D14
- D15
- 1000
- 1001
- 1010
- ANALOG IR
- ABS1
- ABS2
- ABS3
- A0
- A1
- A2
- BUSY
- GENERAL
- COMMON
- ENABLE
- S3: D5
- 0011
- 0100
- 0101
- 0110
- 0111
- D1
- D16
- 1011
- 1100
- 1101
- 1110
- 1111
- D11
- D12
- ABS4
- ABS5
- ABS6
- ABS7
- ABS8
- A3
- A4
- A5
- A6
- A7
- UART PORT | 5v - 3.3V level shifter
- FTDI Serial programming port
- Busy LED indicator

### Library data of the parts
C6-C10 C17 C21 = Cap Semi: Capacitor (Semiconductor SIM Model); Published: 8-Jun-2000; LatestRevisionDate: 29-May-2009; LatestRevisionNote: IPC-7351 Footprint Added.; PackageReference: C1206; Publisher: Altium Limited; PackageDescription: Chip Capacitor
P7 = Header 6: Header, 6-Pin; LatestRevisionDate: 17-Jul-2002; LatestRevisionNote: Re-released for DXP Platform.; Publisher: Altium Limited
R9-R11 R13 = RES
RX TP1-TP16 TX_H TX_L = Test Point: Test Point for Osciloscope measurements
U4 = ATmega328-AU: 8-bit AVR Microcontroller, 32KB Flash, 1KB EEPROM, 2KB SRAM, 32-pin TQFP, Industrial Grade (-40°C to 85°C); Published: 1-Apr-2010; DatasheetVersion: revA, Jan-2010; PackageVersion: revB, Oct-2001; PackageReference: 32A; Publisher: Altium Limited; PackageDescription: 32-Lead, 7x7x1.0 mm Body, 0.8mm Lead Pitch, Thin Profile Plastic Quad Flat Package (TQFP); Supplier 1: Digi-Key; Supplier Part Number 1: ATMEGA328-AU-ND; Supplier 2: Mouser; Supplier Part Number 2: 556-ATMEGA328-AU; Code_JEDEC: MS-026-ABA; ComponentLink1Description: Manufacturer Link; ComponentLink1URL: http://www.atmel.com/products/avr/default.asp?; ComponentLink2Description: ATmega48A/48PA/88A/88PA/168A/168PA/328/328P Datasheet; ComponentLink2URL: http://www.atmel.com/dyn/resources/prod_documents/8271.pdf; ComponentLink3Description: ATmega48A/48PA/88A/88PA/168A/168PA/328/328P Summary; ComponentLink3URL: http://www.atmel.com/dyn/resources/prod_documents/8271S.pdf; ComponentLink4Description: Atmel.com Home; ComponentLink4URL: http://www.atmel.com
U7 = MUX-74HC4067
Y1 = OSC-2-PIN: 2 pin oscilator

## Sheet Digital Ball Sensor.SchDoc
size A4
Used 16 times, as channels Ball Locator/DBS1, Ball Locator/DBS2, Ball Locator/DBS3, Ball Locator/DBS4, Ball Locator/DBS5, Ball Locator/DBS6, Ball Locator/DBS7, Ball Locator/DBS8, Ball Locator/DBS9, Ball Locator/DBS10, Ball Locator/DBS11, Ball Locator/DBS12, Ball Locator/DBS13, Ball Locator/DBS14, Ball Locator/DBS15, Ball Locator/DBS16. Parts and nets are listed once, with the designators drawn on the sheet.
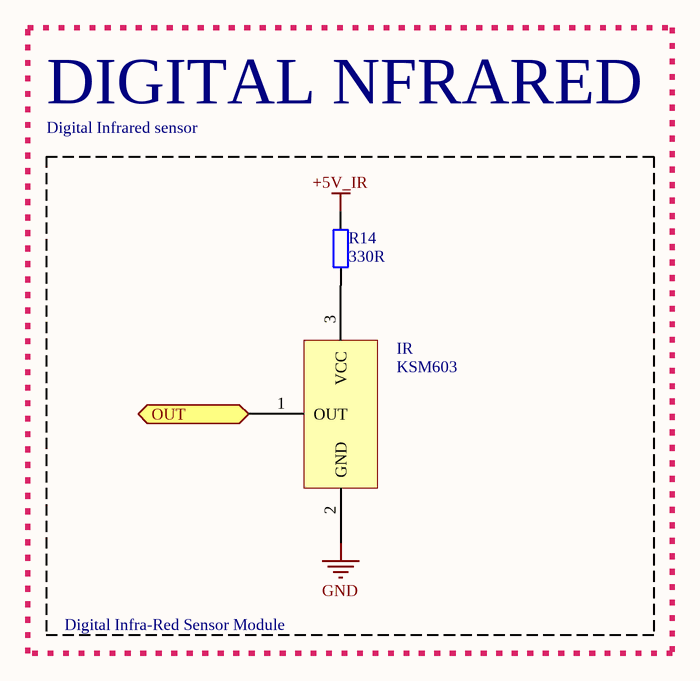
[diagram p8: Digital Ball Sensor.SchDoc]

### Parts
IR  KSM603  [KSM603]
R14  330R  [RES1206]

### Blocks framed on the sheet
DIGITAL NFRARED: IR R14

### Ports
OUT (out)

### Nets
+5V_IR: R14.2
GND: IR.2(GND)
OUT: IR.1(OUT) ; port OUT
NetIR_3: IR.3(VCC) R14.1

### Channels
Ball Locator/DBS1: designators end in _DBS1; ports OUT=D1
Ball Locator/DBS2: designators end in _DBS2; ports OUT=D2
Ball Locator/DBS3: designators end in _DBS3; ports OUT=D3
Ball Locator/DBS4: designators end in _DBS4; ports OUT=D4
Ball Locator/DBS5: designators end in _DBS5; ports OUT=D5
Ball Locator/DBS6: designators end in _DBS6; ports OUT=D6
Ball Locator/DBS7: designators end in _DBS7; ports OUT=D7
Ball Locator/DBS8: designators end in _DBS8; ports OUT=D8
Ball Locator/DBS9: designators end in _DBS9; ports OUT=D9
Ball Locator/DBS10: designators end in _DBS10; ports OUT=D10
Ball Locator/DBS11: designators end in _DBS11; ports OUT=D11
Ball Locator/DBS12: designators end in _DBS12; ports OUT=D12
Ball Locator/DBS13: designators end in _DBS13; ports OUT=D13
Ball Locator/DBS14: designators end in _DBS14; ports OUT=D14
Ball Locator/DBS15: designators end in _DBS15; ports OUT=D15
Ball Locator/DBS16: designators end in _DBS16; ports OUT=D16

### Notes on the sheet
- Digital Infrared sensor
- Digital Infra-Red Sensor Module

### Library data of the parts
IR = DIGITAL-IR-SENSOR: Generic Infra Red Sensor
R14 = RES

## Sheet Analog Ball Sensor.SchDoc
size A4
Used 2 times, as channels Ball Locator/1, Ball Locator/2. Parts and nets are listed once, with the designators drawn on the sheet.
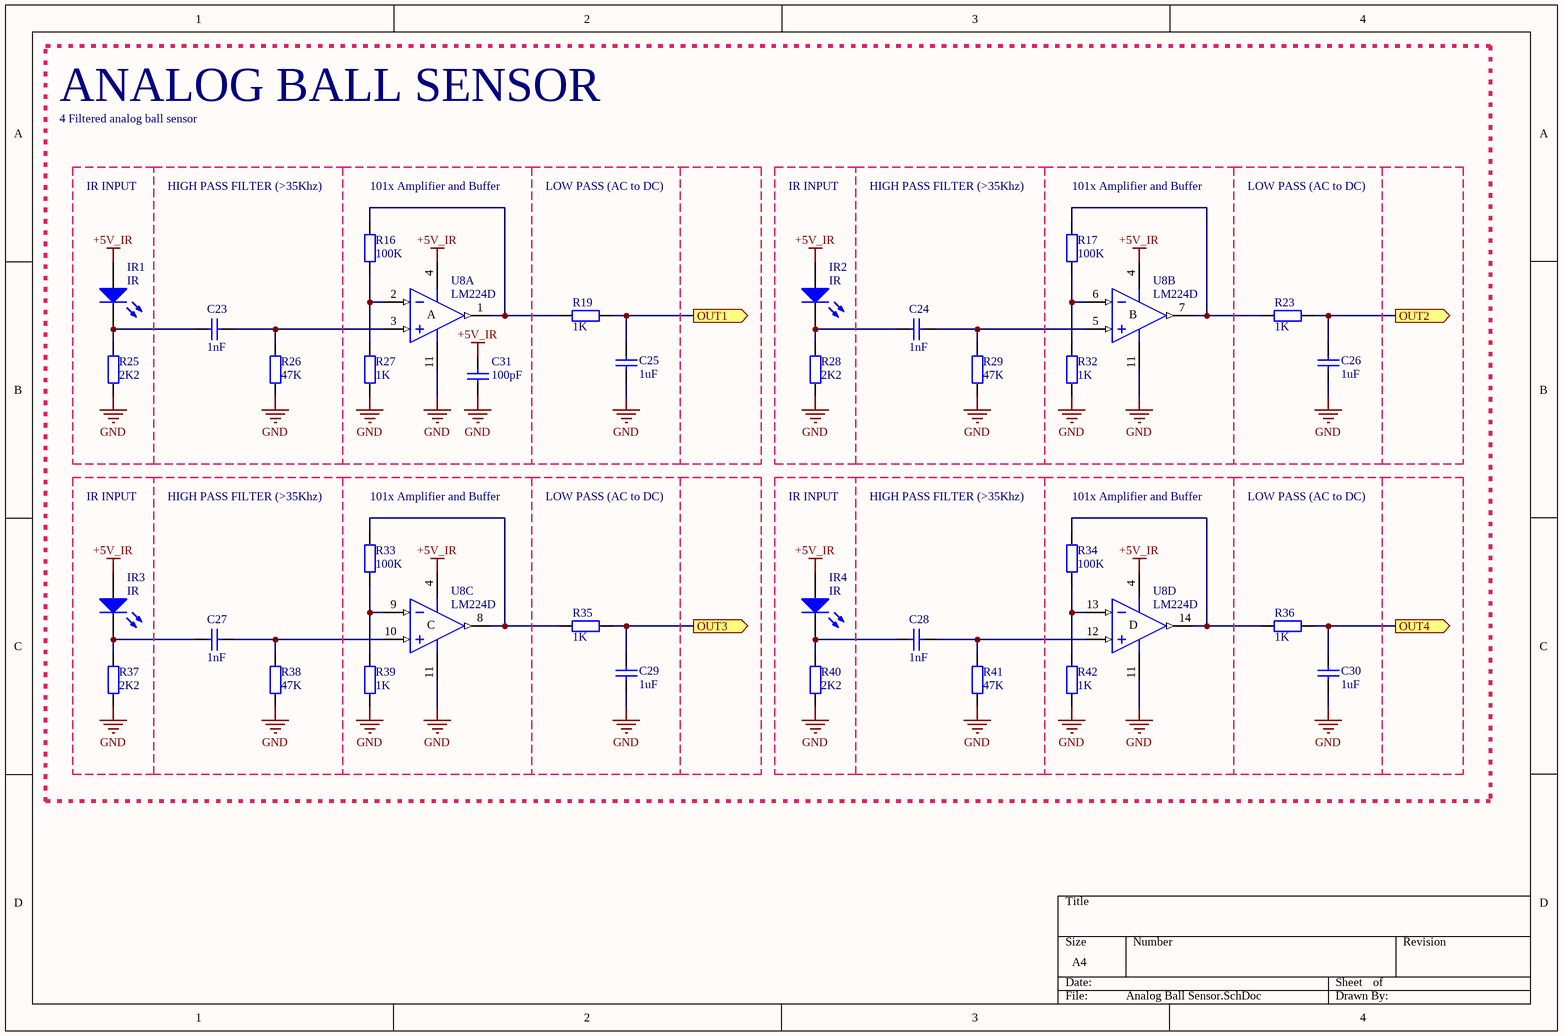
[diagram p9: Analog Ball Sensor.SchDoc]

### Parts
C23  1nF  [C0805]
C24  1nF  [C0805]
C25  1uF  [C0805]
C26  1uF  [C0805]
C27  1nF  [C0805]
C28  1nF  [C0805]
C29  1uF  [C0805]
C30  1uF  [C0805]
C31  value 100pF  [6-0805_N]  (hidden comment: Cap Semi)
IR1  IR  [LED-5mm - Horizontal]
IR2  IR  [LED-5mm - Horizontal]
IR3  IR  [LED-5mm - Horizontal]
IR4  IR  [LED-5mm - Horizontal]
R16  100K  [RES1206]
R17  100K  [RES1206]
R19  1K  [RES1206]
R23  1K  [RES1206]
R25  2K2  [RES1206]
R26  47K  [RES1206]
R27  1K  [RES1206]
R28  2K2  [RES1206]
R29  47K  [RES1206]
R32  1K  [RES1206]
R33  100K  [RES1206]
R34  100K  [RES1206]
R35  1K  [RES1206]
R36  1K  [RES1206]
R37  2K2  [RES1206]
R38  47K  [RES1206]
R39  1K  [RES1206]
R40  2K2  [RES1206]
R41  47K  [RES1206]
R42  1K  [RES1206]
U8  LM224D  [SO14_N]  (parts A,B,C,D of 4)

### Blocks framed on the sheet
ANALOG BALL SENSOR: C23-C31 R16 R17 R19 R23 R26 R27 R29 R32-R36 R38 R39 R41 R42 U8
IR INPUT: IR1 R25
IR INPUT: IR2 R28
IR INPUT: IR3 R37
IR INPUT: IR4 R40

### Ports
OUT1 (out), OUT2 (out), OUT3 (out), OUT4 (out)

### Nets
+5V_IR: C31.2 IR1.1(A) IR2.1(A) IR3.1(A) IR4.1(A) U8.4(V+)
GND: C25.2 C26.2 C29.2 C30.2 C31.1 R25.1 R26.2 R27.2 R28.1 R29.2 R32.2 R37.1 R38.2 R39.2 R40.1 R41.2 R42.2 U8.11(V-)
OUT1: C25.1 R19.2 ; port OUT1
OUT2: C26.1 R23.2 ; port OUT2
OUT3: C29.1 R35.2 ; port OUT3
OUT4: C30.1 R36.2 ; port OUT4
NetC23_1: C23.1 R26.1 U8.3(IN+)
NetC23_2: C23.2 IR1.2(K) R25.2
NetC24_1: C24.1 R29.1 U8.5(IN+)
NetC24_2: C24.2 IR2.2(K) R28.2
NetC27_1: C27.1 R38.1 U8.10(IN+)
NetC27_2: C27.2 IR3.2(K) R37.2
NetC28_1: C28.1 R41.1 U8.12(IN+)
NetC28_2: C28.2 IR4.2(K) R40.2
NetR16_1: R16.1 R19.1 U8.1(OUT)
NetR16_2: R16.2 R27.1 U8.2(IN-)
NetR17_1: R17.1 R23.1 U8.7(OUT)
NetR17_2: R17.2 R32.1 U8.6(IN-)
NetR33_1: R33.1 R35.1 U8.8(OUT)
NetR33_2: R33.2 R39.1 U8.9(IN-)
NetR34_1: R34.1 R36.1 U8.14(OUT)
NetR34_2: R34.2 R42.1 U8.13(IN-)

### Channels
Ball Locator/1: designators end in _1; ports OUT1=A1 OUT2=A0 OUT3=A6 OUT4=A7
Ball Locator/2: designators end in _2; ports OUT1=A4 OUT2=A2 OUT3=A3 OUT4=A5

### Notes on the sheet
- 4 Filtered analog ball sensor
- HIGH PASS FILTER (>35Khz)
- (near R16) 101x Amplifier and Buffer
- LOW PASS (AC to DC)
- (near R17) 101x Amplifier and Buffer
- (near R33) 101x Amplifier and Buffer
- (near R34) 101x Amplifier and Buffer
- (in symbol LM224D, part A) A
- (in symbol LM224D, part B) B
- (in symbol LM224D, part C) C
- (in symbol LM224D, part D) D

### Library data of the parts
C23-C31 = Cap Semi: Capacitor (Semiconductor SIM Model); Published: 8-Jun-2000; LatestRevisionDate: 29-May-2009; LatestRevisionNote: IPC-7351 Footprint Added.; PackageReference: C1206; Publisher: Altium Limited; PackageDescription: Chip Capacitor
IR1-IR4 = LED
R16 R17 R19 R23 R25-R29 R32-R42 = RES
U8 = LM224D: Low-Power Quad Operational Amplifier; Published: 24-Aug-2001; LatestRevisionDate: 13-Apr-2006; LatestRevisionNote: IPC-7351 Footprint Added.; DatasheetVersion: Jun-1999; PackageVersion: Sep-1998; PackageReference: SO14; Publisher: Altium Limited; PackageDescription: 14-Pin Small Outline Integrated Circuit 1.27 mm Pitch; Code_IPC: SOIC127P600-14; ComponentLink1Description: Manufacturer Link; ComponentLink1URL: http://www.st.com/; ComponentLink2Description: Datasheet; ComponentLink2URL: http://www.st.com/stonline/products/literature/ds/2156/lm324.pdf

## Sheet Power Supply.SchDoc
size A4
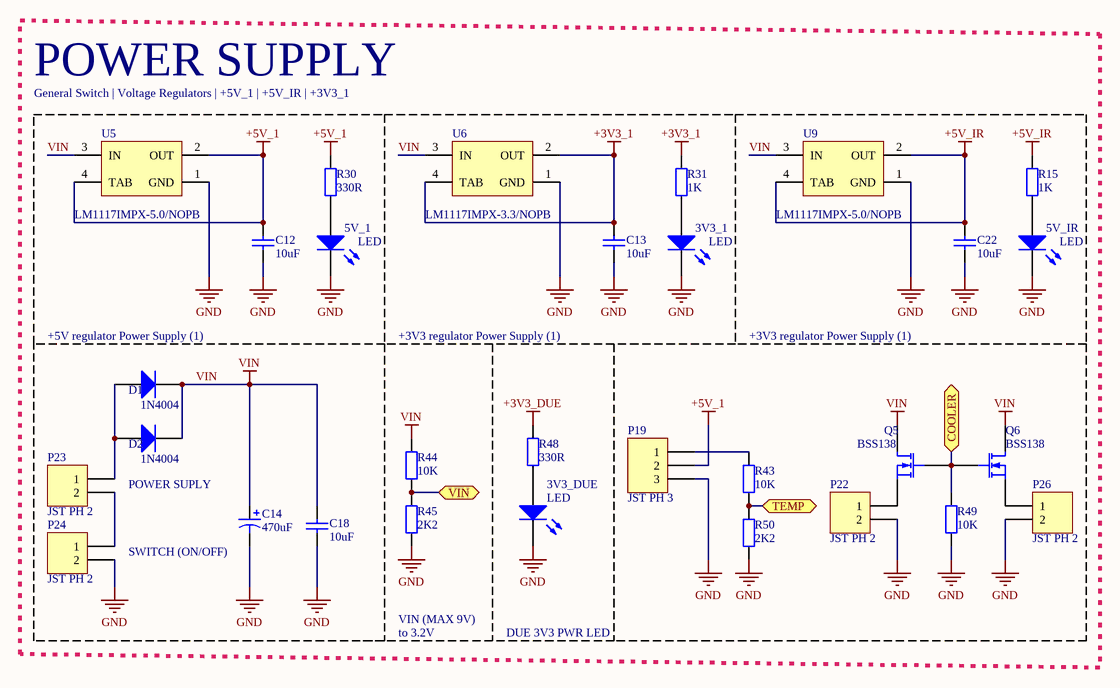
[diagram p10: Power Supply.SchDoc]

### Parts
3V3_1  LED  [LED0805]
3V3_DUE  LED  [LED0805]
5V_1  LED  [LED0805]
5V_IR  LED  [LED0805]
C12  10uF  [C1206]
C13  10uF  [C1206]
C14  470uF  [E]
C18  10uF  [C1206]
C22  10uF  [C1206]
D1  1N4004  [DIODESMA]
D2  1N4004  [DIODESMA]
P19  JST PH 3  [B3B-PH-K]
P22  JST PH 2  [B2B-PH-K]
P23  JST PH 2  [B2B-PH-K]
P24  JST PH 2  [B2B-PH-K]
P26  JST PH 2  [B2B-PH-K]
Q5  BSS138  [SOT23]
Q6  BSS138  [SOT23]
R15  1K  [RES1206]
R30  330R  [RES1206]
R31  1K  [RES1206]
R43  10K  [RES1206]
R44  10K  [RES1206]
R45  2K2  [RES1206]
R48  330R  [RES1206]
R49  10K  [RES1206]
R50  2K2  [RES1206]
U5  LM1117IMPX-5.0/NOPB  [MP04A_N]
U6  LM1117IMPX-3.3/NOPB  [MP04A_N]
U9  LM1117IMPX-5.0/NOPB  [MP04A_N]

### Blocks framed on the sheet
POWER SUPPLY: 3V3_1 3V3_DUE 5V_IR C13 C14 C18 C22 D1 D2 P19 P22-P24 P26 Q5 Q6 R15 R31 R43-R45 R48-R50 U6 U9
+5V regulator Power Supply (1): 5V_1 C12 R30 U5

### Ports
COOLER, TEMP, VIN

### Nets
+3V3_1: C13.2 R31.2 U6.2(OUT) U6.4(TAB)
+3V3_DUE: R48.2
+5V_1: C12.2 P19.2 R30.2 U5.2(OUT) U5.4(TAB)
+5V_IR: C22.2 R15.2 U9.2(OUT) U9.4(TAB)
GND: 3V3_1.2(K) 3V3_DUE.2(K) 5V_1.2(K) 5V_IR.2(K) C12.1 C13.1 C14.2 C18.1 C22.1 P19.3 P22.2 P24.2 P26.2 R45.1 R49.2 R50.2 U5.1(GND) U6.1(GND) U9.1(GND)
VIN: C14.1 C18.2 D1.1(K) D2.1(K) Q5.1(D) Q6.1(D) R44.2 U5.3(IN) U6.3(IN) U9.3(IN)
Net3V3_1_1: 3V3_1.1(A) R31.1
Net3V3_DUE_1: 3V3_DUE.1(A) R48.1
Net5V_1_1: 5V_1.1(A) R30.1
Net5V_IR_1: 5V_IR.1(A) R15.1
Net*_11: Q5.3(G) Q6.3(G) R49.1 ; port COOLER
Net*_A10: R43.2 R50.1 ; port TEMP
Net*_A11: R44.1 R45.2 ; port VIN
NetD1_2: D1.2(A) D2.2(A) P23.1
NetP19_1: P19.1 R43.1
NetP22_1: P22.1 Q5.2(S)
NetP23_2: P23.2 P24.1
NetP26_1: P26.1 Q6.2(S)

### Notes on the sheet
- General Switch | Voltage Regulators | +5V_1 | +5V_IR | +3V3_1
- +3V3 regulator Power Supply (1)
- POWER SUPLY
- SWITCH (ON/OFF)
- VIN (MAX 9V)
- to 3.2V
- DUE 3V3 PWR LED

### Library data of the parts
C12 C13 C18 C22 = Cap Semi: Capacitor (Semiconductor SIM Model); Published: 8-Jun-2000; LatestRevisionDate: 29-May-2009; LatestRevisionNote: IPC-7351 Footprint Added.; PackageReference: C1206; Publisher: Altium Limited; PackageDescription: Chip Capacitor; Value: 10uF
C14 = 94SA107X0010EBP: Solid Aluminum Capacitor with Organic Semiconductor Electrolyte: 100uF, 10V, Bulk Pack; Note: Part Numbers shown are for ± 20% capacitance tolerance (X0).; PCB_Layout: Complies with Manufacturer's Recommendation.; DrillSize: Nominal, Rounded to the nearest 0.1mm; Published: 19-Mar-2004; DatasheetDocument: 29-Jun-2001; PackageReference: E; Publisher: Altium Limited; ComponentLink1Description: Manufacturer Link; ComponentLink1URL: http://www.vishay.com/; ComponentLink2Description: Datasheet; ComponentLink2URL: http://www.vishay.com/docs/90003/94sa.pdf; Value: 100uF
D1 D2 = DIODE
Q5 Q6 = BSS138: as Q4 on sheet LCD; Published: 17-Dec-2003; DatasheetVersion: Mar-96; PackageVersion: 1996; PackageReference: SOT23; Publisher: Altium Limited; PackageDescription: SOT-23; 3 Leads; Body 3.1 x 2.5 mm, inc. leads (LxW max), Alternate Lead Configuration; ComponentLink1Description: Manufacturer Link; ComponentLink1URL: http://www.zetex.com/; ComponentLink2Description: Datasheet; ComponentLink2URL: www.zetex.com/3.0/pdf/BSS138.pdf
R15 R30 R31 R43-R45 R48-R50 = RES
U5 U9 = LM1117IMPX-5.0/NOPB: 800mA Low-Dropout Linear Regulator, 4-pin SOT-223, Pb-Free; Manufacturer: National Semiconductor; PackageTopMarking: XYTT*N06B; PowerWise: N; CompType: LDO IC; Published: 1-Mar-2010; DatasheetVersion: Apr-2006; PackageVersion: revB, Apr-2003; PackageReference: MP04A; Publisher: Altium Limited; PackageDescription: Molded SOT-223, 6.50 x 3.56 x 1.6mm Body, 4 Lead, 2.3mm Pitch; Supplier 1: Digi-Key; Supplier Part Number 1: LM1117IMPX-5.0-ND; PartNumber: LM1117IMPX-5.0/NOPB; RoHS: Y; PinCount: 4; Code_JEDEC: TO-261-AA; Code_IPC: SOT223-4; ComponentLink1Description: LM1117 Datasheet; ComponentLink1URL: http://www.national.com/ds/LM/LM1117.pdf; ComponentLink2Description: LM1117 Web Page; ComponentLink2URL: http://www.national.com/pf/LM/LM1117.html; ComponentLink3Description: MP04A Package Page; ComponentLink3URL: http://www.national.com/packaging/folders/mp04a.html
U6 = LM1117IMPX-3.3/NOPB: 800mA Low-Dropout Linear Regulator, 4-pin SOT-223, Pb-Free; Manufacturer: National Semiconductor; PackageTopMarking: XYTT*N05B; PowerWise: N; CompType: LDO IC; Published: 1-Mar-2010; DatasheetVersion: Apr-2006; PackageVersion: revB, Apr-2003; PackageReference: MP04A; Publisher: Altium Limited; PackageDescription: Molded SOT-223, 6.50 x 3.56 x 1.6mm Body, 4 Lead, 2.3mm Pitch; Supplier 1: Digi-Key; Supplier Part Number 1: LM1117IMPX-3.3-ND; PartNumber: LM1117IMPX-3.3/NOPB; RoHS: Y; PinCount: 4; Code_JEDEC: TO-261-AA; Code_IPC: SOT223-4; ComponentLink1Description: LM1117 Datasheet; ComponentLink1URL: http://www.national.com/ds/LM/LM1117.pdf; ComponentLink2Description: LM1117 Web Page; ComponentLink2URL: http://www.national.com/pf/LM/LM1117.html; ComponentLink3Description: MP04A Package Page; ComponentLink3URL: http://www.national.com/packaging/folders/mp04a.html

## Sheet Distance Sensors.SchDoc
size A4
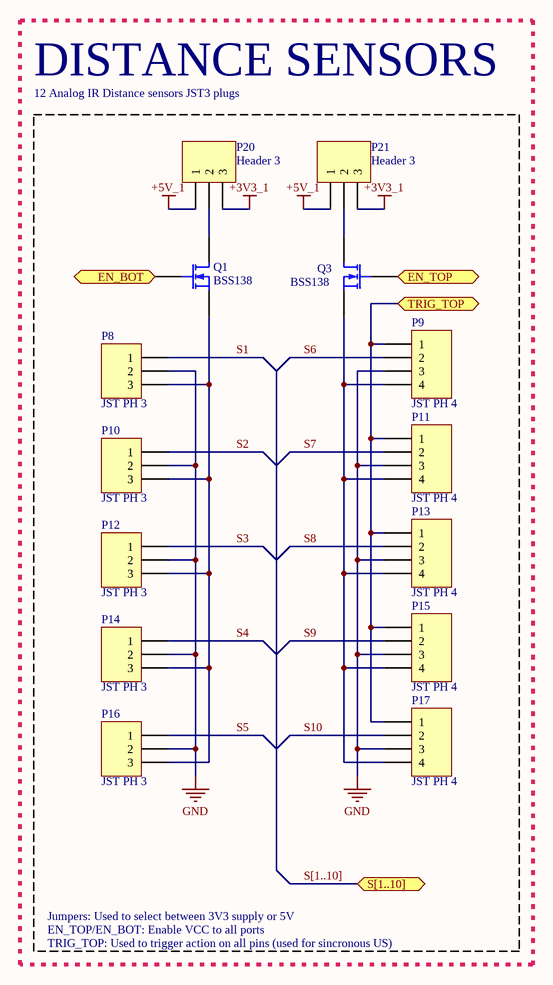
[diagram p11: Distance Sensors.SchDoc]

### Parts
P8  JST PH 3  [B3B-PH-K]
P9  JST PH 4  [B4B-PH-K]
P10  JST PH 3  [B3B-PH-K]
P11  JST PH 4  [B4B-PH-K]
P12  JST PH 3  [B3B-PH-K]
P13  JST PH 4  [B4B-PH-K]
P14  JST PH 3  [B3B-PH-K]
P15  JST PH 4  [B4B-PH-K]
P16  JST PH 3  [B3B-PH-K]
P17  JST PH 4  [B4B-PH-K]
P20  Header 3  [HDR1X3]
P21  Header 3  [HDR1X3]
Q1  BSS138  [SOT23]
Q3  BSS138  [SOT23]

### Ports
EN_BOT, EN_TOP, S[1..10], TRIG_TOP

### Nets
+3V3_1: P20.3 P21.3
+5V_1: P20.1 P21.1
GND: P8.2 P9.3 P10.2 P11.3 P12.2 P13.3 P14.2 P15.3 P16.2 P17.3
S1: P8.1
S2: P10.1
S3: P12.1
S4: P14.1
S5: P16.1
S6: P9.2
S7: P11.2
S8: P13.2
S9: P15.2
S10: P17.2
Net*_4: Q3.3(G) ; port EN_TOP
Net*_5: Q1.3(G) ; port EN_BOT
Net*_10: P9.1 P11.1 P13.1 P15.1 P17.1 ; port TRIG_TOP
NetP8_3: P8.3 P10.3 P12.3 P14.3 P16.3 Q1.2(S)
NetP9_4: P9.4 P11.4 P13.4 P15.4 P17.4 Q3.2(S)
NetP20_2: P20.2 Q1.1(D)
NetP21_2: P21.2 Q3.1(D)

### Buses and harness runs
bus S[1..10] = port S[1..10]

### Notes on the sheet
- DISTANCE SENSORS
- 12 Analog IR Distance sensors JST3 plugs
- EN_TOP/EN_BOT: Enable VCC to all ports
- TRIG_TOP: Used to trigger action on all pins (used for sincronous US)
- Jumpers: Used to select between 3V3 supply or 5V

### Library data of the parts
P20 P21 = Header 3: Header, 3-Pin; LatestRevisionDate: 17-Jul-2002; LatestRevisionNote: Re-released for DXP Platform.; Publisher: Altium Limited
Q1 Q3 = BSS138: as Q4 on sheet LCD; Published: 17-Dec-2003; DatasheetVersion: Mar-96; PackageVersion: 1996; PackageReference: SOT23; Publisher: Altium Limited; PackageDescription: SOT-23; 3 Leads; Body 3.1 x 2.5 mm, inc. leads (LxW max), Alternate Lead Configuration; ComponentLink1Description: Manufacturer Link; ComponentLink1URL: http://www.zetex.com/; ComponentLink2Description: Datasheet; ComponentLink2URL: www.zetex.com/3.0/pdf/BSS138.pdf

## Sheet Servos.SchDoc
size A4
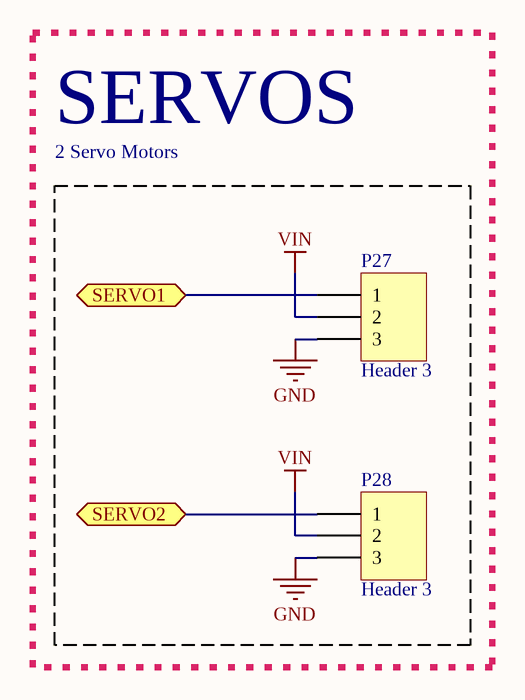
[diagram p12: Servos.SchDoc]

### Parts
P27  Header 3  [HDR1X3]
P28  Header 3  [HDR1X3]

### Blocks framed on the sheet
2 Servo Motors: P27 P28

### Ports
SERVO1, SERVO2

### Nets
GND: P27.3 P28.3
VIN: P27.2 P28.2
Net*_12: P27.1 ; port SERVO1
Net*_13: P28.1 ; port SERVO2

### Notes on the sheet
- SERVOS

### Library data of the parts
P27 P28 = Header 3: Header, 3-Pin; LatestRevisionDate: 17-Jul-2002; LatestRevisionNote: Re-released for DXP Platform.; Publisher: Altium Limited

## Nets that join several sheets
+3V3_1: IMU (8 pins), Bluetooth (P3.1 xBee.1), Interface (R20.1 R21.1), Power Supply (C13.2 R31.2 U6.2 U6.4), Distance Sensors (P20.3 P21.3)
+3V3_DUE: Core (*.3V3), LCD (LCD1.2 LCD1.6 Q4.1), Power Supply (R48.2)
+5V_1: Interface (10 pins), Ball Locator (8 pins), Power Supply (5 pins), Distance Sensors (P20.1 P21.1)
+5V_IR: Ball Locator/DBS1 (R14_DBS1.2), Ball Locator/DBS2 (R14_DBS2.2), Ball Locator/DBS3 (R14_DBS3.2), Ball Locator/DBS4 (R14_DBS4.2), Ball Locator/DBS5 (R14_DBS5.2), Ball Locator/DBS6 (R14_DBS6.2), Ball Locator/DBS7 (R14_DBS7.2), Ball Locator/DBS8 (R14_DBS8.2), Ball Locator/DBS9 (R14_DBS9.2), Ball Locator/DBS10 (R14_DBS10.2), Ball Locator/DBS11 (R14_DBS11.2), Ball Locator/DBS12 (R14_DBS12.2), Ball Locator/DBS13 (R14_DBS13.2), Ball Locator/DBS14 (R14_DBS14.2), Ball Locator/DBS15 (R14_DBS15.2), Ball Locator/DBS16 (R14_DBS16.2), Ball Locator/1 (6 pins), Ball Locator/2 (6 pins), Power Supply (C22.2 R15.2 U9.2 U9.4)
GND: Core (*.GND2 *.GND3 *.GND5), IMU (10 pins), Bluetooth (P3.2 xBee.10), HB1 (HB_HB1.GND3 P18_HB1.2 R2_HB1.1), HB2 (HB_HB2.GND3 P18_HB2.2 R2_HB2.1), LCD (LCD1.1 R24.2), Interface (17 pins), Ball Locator (14 pins), Ball Locator/DBS1 (IR_DBS1.2), Ball Locator/DBS2 (IR_DBS2.2), Ball Locator/DBS3 (IR_DBS3.2), Ball Locator/DBS4 (IR_DBS4.2), Ball Locator/DBS5 (IR_DBS5.2), Ball Locator/DBS6 (IR_DBS6.2), Ball Locator/DBS7 (IR_DBS7.2), Ball Locator/DBS8 (IR_DBS8.2), Ball Locator/DBS9 (IR_DBS9.2), Ball Locator/DBS10 (IR_DBS10.2), Ball Locator/DBS11 (IR_DBS11.2), Ball Locator/DBS12 (IR_DBS12.2), Ball Locator/DBS13 (IR_DBS13.2), Ball Locator/DBS14 (IR_DBS14.2), Ball Locator/DBS15 (IR_DBS15.2), Ball Locator/DBS16 (IR_DBS16.2), Ball Locator/1 (18 pins), Ball Locator/2 (18 pins), Power Supply (19 pins), Distance Sensors (10 pins), Servos (P27.3 P28.3)
VIN: Core (*.VIN), HB1 (P18_HB1.1), HB2 (P18_HB2.1), Power Supply (10 pins), Servos (P27.2 P28.2)
A0: Ball Locator (U4.23), Ball Locator/1 (C26_1.1 R23_1.2)
A1: Ball Locator (U4.24), Ball Locator/1 (C25_1.1 R19_1.2)
A2: Ball Locator (U4.25), Ball Locator/2 (C26_2.1 R23_2.2)
A3: Ball Locator (U4.26), Ball Locator/2 (C29_2.1 R35_2.2)
A4: Ball Locator (U4.27), Ball Locator/2 (C25_2.1 R19_2.2)
A5: Ball Locator (U4.28), Ball Locator/2 (C30_2.1 R36_2.2)
A6: Ball Locator (U4.19), Ball Locator/1 (C29_1.1 R35_1.2)
A7: Ball Locator (U4.22), Ball Locator/1 (C30_1.1 R36_1.2)
BL.RX: Core (*.14), Ball Locator (P7.4 RX.1 U4.30)
BL.TX: Core (*.15), Ball Locator (R10.1 R11.2 TX_L.1)
D1: Ball Locator (TP1.1 U7.5), Ball Locator/DBS1 (IR_DBS1.1)
D2: Ball Locator (TP3.1 U7.4), Ball Locator/DBS2 (IR_DBS2.1)
D3: Ball Locator (TP5.1 U7.3), Ball Locator/DBS3 (IR_DBS3.1)
D4: Ball Locator (TP7.1 U7.2), Ball Locator/DBS4 (IR_DBS4.1)
D5: Ball Locator (TP9.1 U7.23), Ball Locator/DBS5 (IR_DBS5.1)
D6: Ball Locator (TP11.1 U7.22), Ball Locator/DBS6 (IR_DBS6.1)
D7: Ball Locator (TP13.1 U7.21), Ball Locator/DBS7 (IR_DBS7.1)
D8: Ball Locator (TP15.1 U7.20), Ball Locator/DBS8 (IR_DBS8.1)
D9: Ball Locator (TP2.1 U7.19), Ball Locator/DBS9 (IR_DBS9.1)
D10: Ball Locator (TP4.1 U7.18), Ball Locator/DBS10 (IR_DBS10.1)
D11: Ball Locator (TP6.1 U7.17), Ball Locator/DBS11 (IR_DBS11.1)
D12: Ball Locator (TP8.1 U7.16), Ball Locator/DBS12 (IR_DBS12.1)
D13: Ball Locator (TP10.1 U7.9), Ball Locator/DBS13 (IR_DBS13.1)
D14: Ball Locator (TP12.1 U7.8), Ball Locator/DBS14 (IR_DBS14.1)
D15: Ball Locator (TP14.1 U7.7), Ball Locator/DBS15 (IR_DBS15.1)
D16: Ball Locator (TP16.1 U7.6), Ball Locator/DBS16 (IR_DBS16.1)
DB0: Core (*.33), LCD (LCD1.21)
DB1: Core (*.34), LCD (LCD1.22)
DB2: Core (*.35), LCD (LCD1.23)
DB3: Core (*.36), LCD (LCD1.24)
DB4: Core (*.37), LCD (LCD1.25)
DB5: Core (*.38), LCD (LCD1.26)
DB6: Core (*.39), LCD (LCD1.27)
DB7: Core (*.40), LCD (LCD1.28)
DB8: Core (*.51), LCD (LCD1.7)
DB9: Core (*.50), LCD (LCD1.8)
DB10: Core (*.49), LCD (LCD1.9)
DB11: Core (*.48), LCD (LCD1.10)
DB12: Core (*.47), LCD (LCD1.11)
DB13: Core (*.46), LCD (LCD1.12)
DB14: Core (*.45), LCD (LCD1.13)
DB15: Core (*.44), LCD (LCD1.14)
LCD_CS: Core (*.43), LCD (LCD1.15)
LCD_RESET: Core (*.53), LCD (LCD1.17)
LCD_RS: Core (*.41), LCD (LCD1.4)
LCD_WR: Core (*.42), LCD (LCD1.5)
Net*_3: Core (*.3), Interface (C4.2 R6.1 R7.2)
Net*_4: Core (*.4), Distance Sensors (Q3.3)
Net*_5: Core (*.5), Distance Sensors (Q1.3)
Net*_6: Core (*.6), Interface (C19.1 R20.2 SW1.2)
Net*_7: Core (*.7), Interface (C20.1 R21.2 SW2.2)
Net*_8: Core (*.8), Interface (Q2.3)
Net*_9: Core (*.9), LCD (Q4.3)
Net*_10: Core (*.10), Distance Sensors (5 pins)
Net*_11: Core (*.11), Power Supply (Q5.3 Q6.3 R49.1)
Net*_12: Core (*.12), Servos (P27.1)
Net*_13: Core (*.13), Servos (P28.1)
Net*_17: Core (*.17), HB2 (R1_HB2.1 R2_HB2.2)
Net*_19: Core (*.19), HB1 (R1_HB1.1 R2_HB1.2)
Net*_22: Core (*.22), Interface (Q7.3 R52.1)
Net*_32: Core (*.32), IMU (IMU_INT.1 U1.12)
Net*_A10: Core (*.A10), Power Supply (R43.2 R50.1)
Net*_A11: Core (*.A11), Power Supply (R44.1 R45.2)
Net*_SCL1: Core (*.SCL1), IMU (IMU_SCL.1 R46.2 U1.23)
Net*_SDA1: Core (*.SDA1), IMU (IMU_SDA.1 R47.2 U1.24)
RX: Core (*.16), HB2 (HB_HB2.RX)
RX: Core (*.18), HB1 (HB_HB1.RX)
S1: Core (*.A0), Distance Sensors (P8.1)
S2: Core (*.A1), Distance Sensors (P10.1)
S3: Core (*.A2), Distance Sensors (P12.1)
S4: Core (*.A3), Distance Sensors (P14.1)
S5: Core (*.A4), Distance Sensors (P16.1)
S6: Core (*.A5), Distance Sensors (P9.2)
S7: Core (*.A6), Distance Sensors (P11.2)
S8: Core (*.A7), Distance Sensors (P13.2)
S9: Core (*.A8), Distance Sensors (P15.2)
S10: Core (*.A9), Distance Sensors (P17.2)
SD_CLK: Core (*.SCK), LCD (LCD1.36)
SD_CS: Core (*.52), LCD (LCD1.38)
SD_MISO: Core (*.MISO), LCD (LCD1.35)
SD_MOSI: Core (*.MOSI), LCD (LCD1.37)
T_CLK: Core (*.27), LCD (LCD1.29)
T_CS: Core (*.28), LCD (LCD1.30)
T_DIN: Core (*.29), LCD (LCD1.31)
T_IRQ: Core (*.31), LCD (LCD1.34)
T_OUT: Core (*.30), LCD (LCD1.33)
UART.RX: Core (*.1), Bluetooth (P3.4 xBee.3)
UART.TX: Core (*.0), Bluetooth (P3.3 xBee.2)